# EasyEDA Pro project test Project_2026-04-05_21-01-09.eprj, schematic Schematic1
Board Name: Board1; Create Date: 2026-05-06; Page Name: P1; Project Name: test Project_2026-04-05_21-01-09; Schematic Name: Schematic1; Update Date: 2026-06-16; Company: EasyEDA.com; Page Size: A4; Version: V1.0
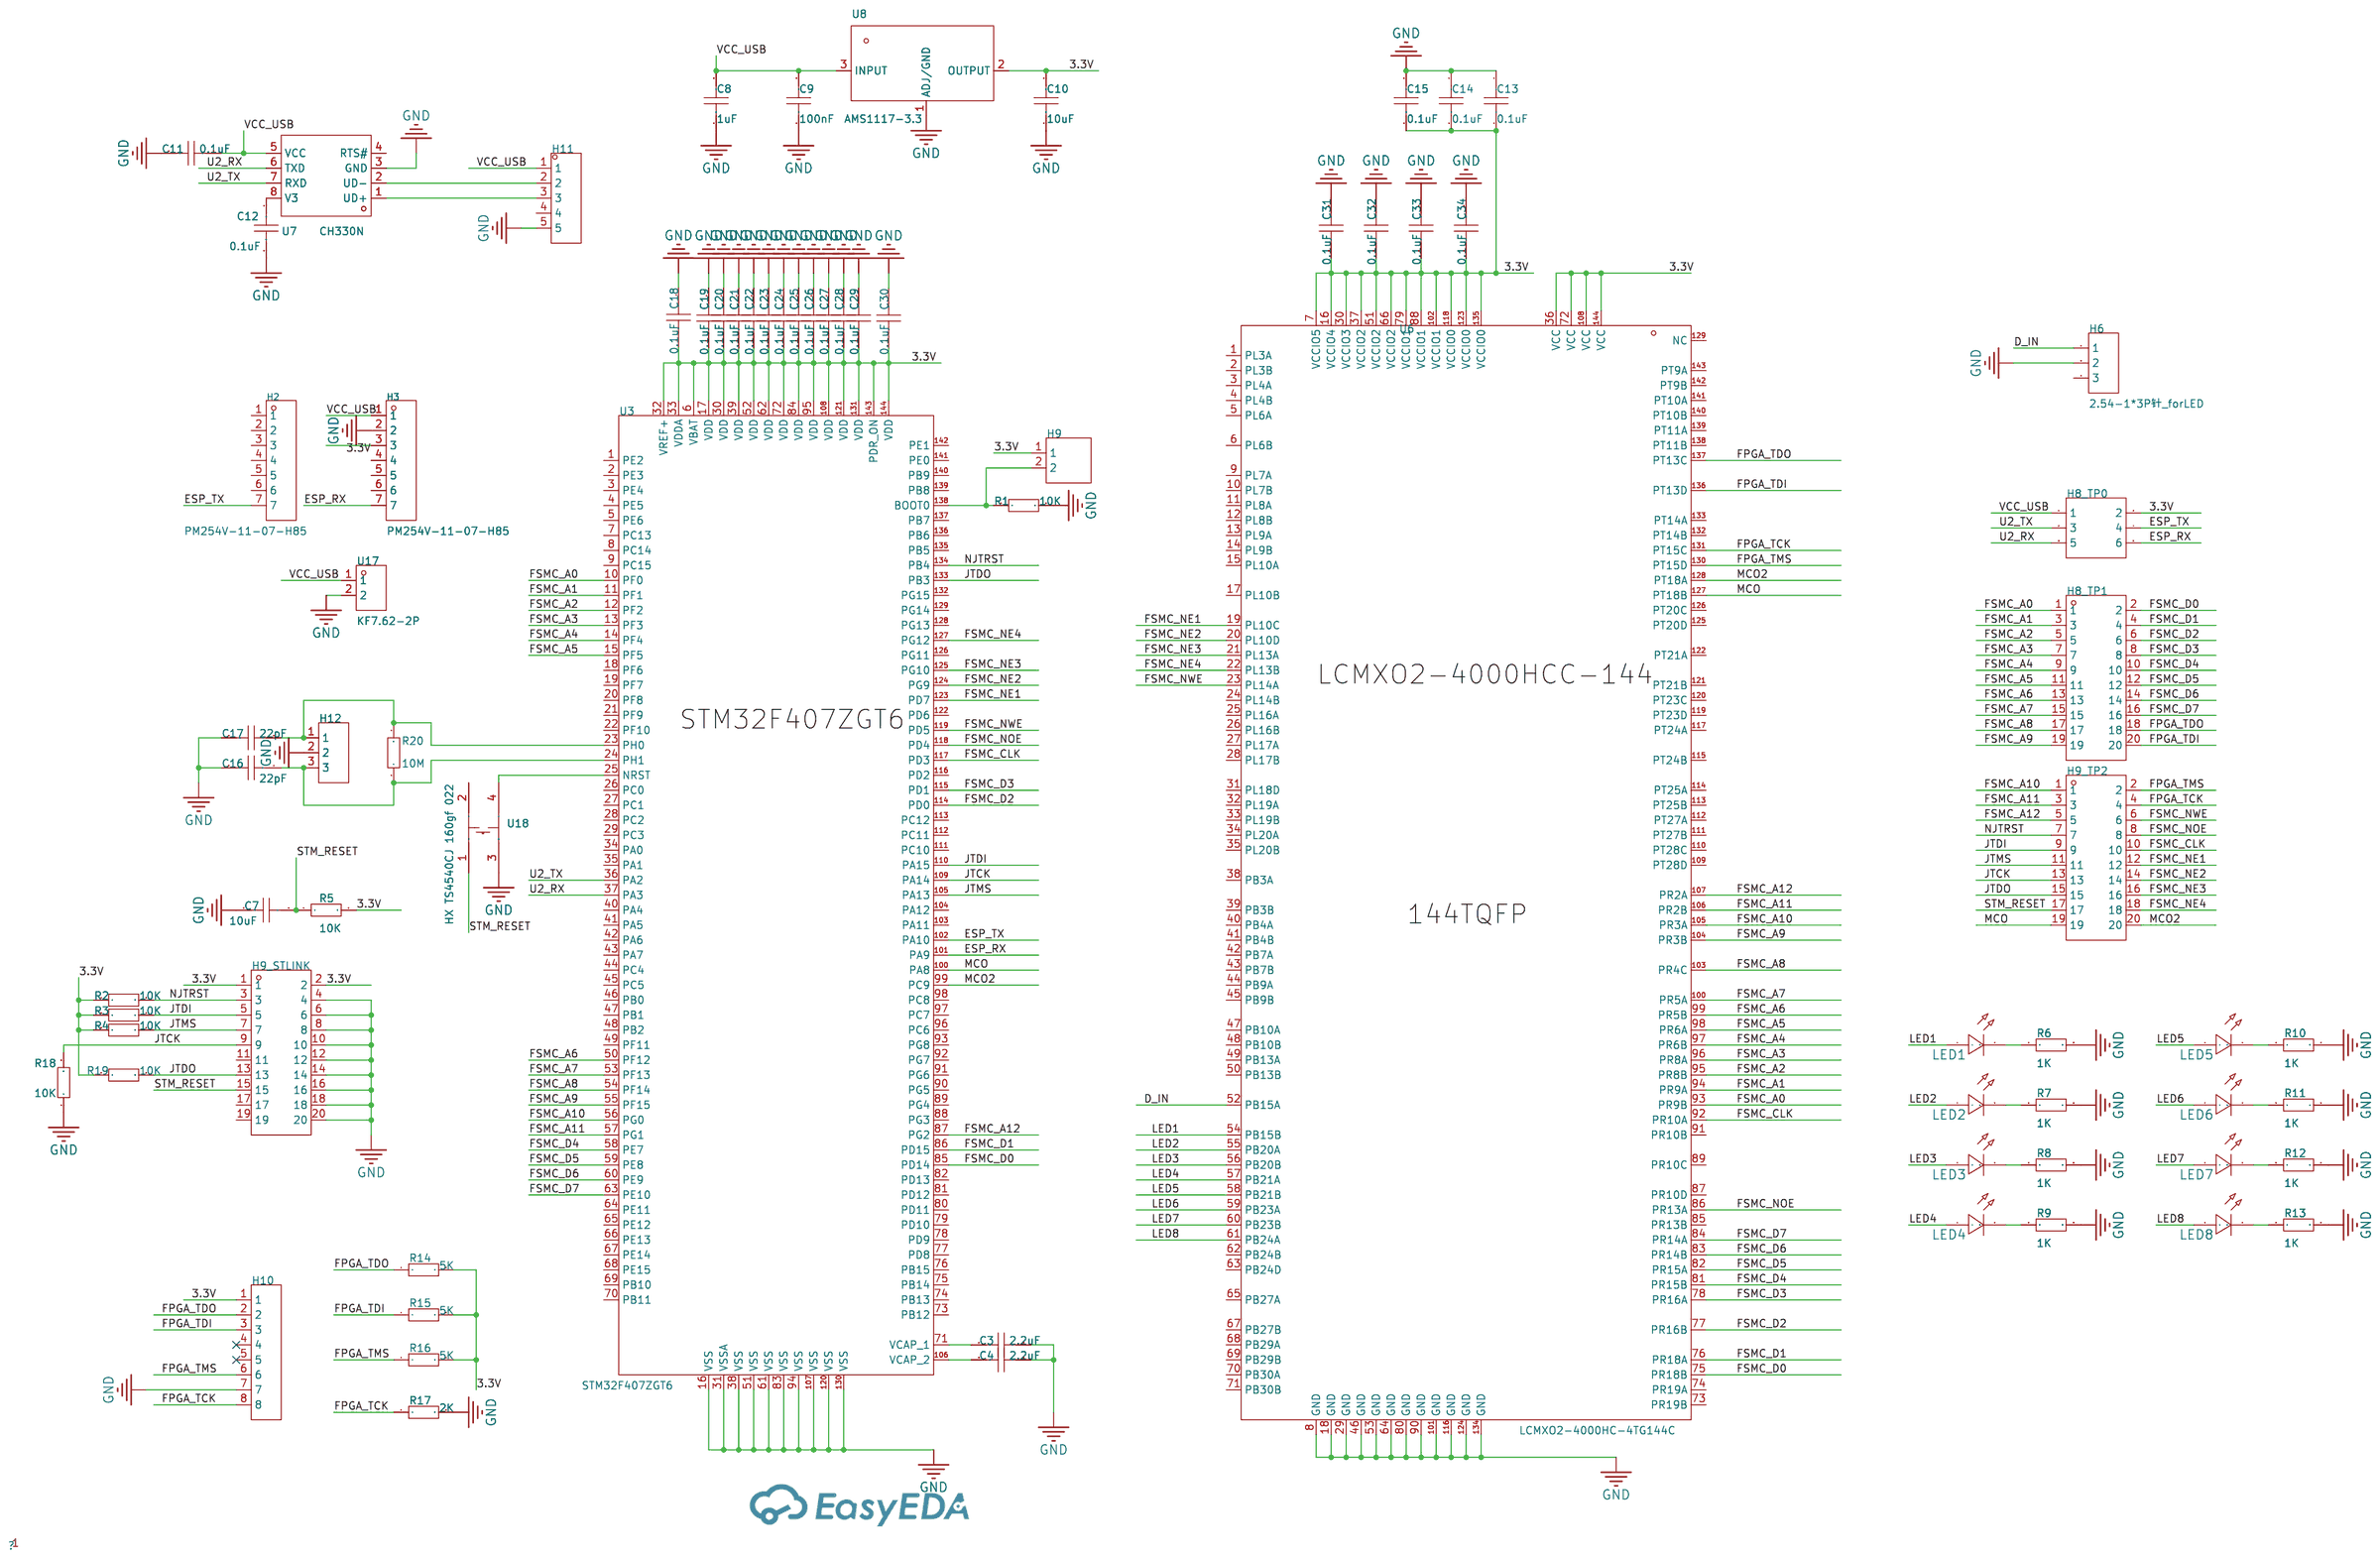
[diagram p0: schematic sheet]

## Parts
C3  2.2uF  [C0805]
C4  2.2uF  [C0805]
C7  10uF  [C0805]
C8  1uF  [C0805]
C9  100nF  [C0805]
C10  10uF  [C0805]
C11  0.1uF  [C0805]
C12  0.1uF  [C0805]
C13  0.1uF  [C0805]
C14  0.1uF  [C0805]
C15  0.1uF  [C0805]
C16  22pF  [C0805]
C17  22pF  [C0805]
C18  0.1uF  [C0805]
C19  0.1uF  [C0805]
C20  0.1uF  [C0805]
C21  0.1uF  [C0805]
C22  0.1uF  [C0805]
C23  0.1uF  [C0805]
C24  0.1uF  [C0805]
C25  0.1uF  [C0805]
C26  0.1uF  [C0805]
C27  0.1uF  [C0805]
C28  0.1uF  [C0805]
C29  0.1uF  [C0805]
C30  0.1uF  [C0805]
C31  0.1uF  [C0805]
C32  0.1uF  [C0805]
C33  0.1uF  [C0805]
C34  0.1uF  [C0805]
H2  PM254V-11-07-H85  [HDR-TH_7P-P2.54-V-F]
H3  PM254V-11-07-H85  [HDR-TH_7P-P2.54-V-F]
H6  2.54-1*3P针_forLED  [HDR-TH_3P-P2.54-V-M-1]
H8_TP0  -  [HDR-TH_6P-P2.54-V-R2-C3-S2.54_A2541WV-2X3P]
H8_TP1  -  [HDR-TH_20P-P2.54-V-M-R2-C10-S2.54]
H9  -  [HDR-TH_2P-P2.54-V-M-1]
H9_STLINK  -  [HDR-TH_20P-P2.54-V-M-R2-C10-S2.54]
H9_TP2  -  [HDR-TH_20P-P2.54-V-M-R2-C10-S2.54]
H10  -  [HDR-TH_8P-P2.54-V-F-1]
H11  -  [HDR-TH_5P-P2.54-V-M]
H12  -  [HDR-TH_3P-P2.54-V-F]
LED1  -  [LED0805-R-RD]
LED2  -  [LED0805-R-RD]
LED3  -  [LED0805-R-RD]
LED4  -  [LED0805-R-RD]
LED5  -  [LED0805-R-RD]
LED6  -  [LED0805-R-RD]
LED7  -  [LED0805-R-RD]
LED8  -  [LED0805-R-RD]
R1  10K  [R0805]
R2  10K  [R0805]
R3  10K  [R0805]
R4  10K  [R0805]
R5  10K  [R0805]
R6  1K  [R0805]
R7  1K  [R0805]
R8  1K  [R0805]
R9  1K  [R0805]
R10  1K  [R0805]
R11  1K  [R0805]
R12  1K  [R0805]
R13  1K  [R0805]
R14  5K  [R0805]
R15  5K  [R0805]
R16  5K  [R0805]
R17  2K  [R0805]
R18  10K  [R0805]
R19  10K  [R0805]
R20  10M  [R0805]
U3  STM32F407ZGT6  [LQFP-144_L20.0-W20.0-P0.50-LS22.0-BL]
U6  LCMXO2-4000HC-4TG144C  [TQFP-144_L20.0-W20.0-P0.50-LS22.0-BL]
U7  CH330N  [SOP-8_L4.9-W3.9-P1.27-LS6.0-BL]
U8  AMS1117-3.3  [SOT-223-3_L6.7-W3.7-P2.30-LS7.0-BR]
U17  KF7.62-2P  [CONN-TH_KF7.62-2P]
U18  HX TS4540CJ 160gf 022  [KEY-TH_4P-L4.5-W4.5-P3.00-LS5.0-TL]

## Library data of the parts
C3 C4 C7-C34 = CAP_0805: Supplier Footprint: 0805
H2 H3 = PM254V-11-07-H85: Holes Structure:1x7P Pitch:2.54mm Row Spacing:- Circular Hole / Square Hole:Square Hole Mounting Type:Through Hole Number of Rows:1 Number of Positions:7P Current Rating:3A Voltage Rating (Max):250V Holes Direction:Top Insulation Height:- Operating Temper; LCSC Part Name: 间距:2.54mm 1x7P 直插; Supplier Part: C2832270; Manufacturer: XFCN(兴飞); Supplier Footprint: 插件,P=2.54mm; JLCPCB Part Class: 扩展库; Datasheet: https://item.szlcsc.com/datasheet/PM254V-11-07-H85/2989788.html; Supplier: LCSC; Holes Structure: 1x7P; Pitch: 2.54mm; Circular Hole / Square Hole: Square Hole; Mounting Type: Through Hole; Number of Rows: 1; Number of Positions: 7P; Current Rating: 3A; Voltage Rating (Max): 250V; Holes Direction: Top; Operating Temperature: -40℃~+105℃
H6 = 2.54-1*3P针: LCSC Part Name: 1x3P 间距:2.54mm 方针 直插; Supplier Part: C49257; Manufacturer: BOOMELE(博穆精密); Supplier Footprint: 插件,P=2.54mm; JLCPCB Part Class: 扩展库; Datasheet: https://item.szlcsc.com/datasheet/2.54-1*3P%25E9%2592%2588/50265.html; Supplier: LCSC; Pin Structure: 1x3P; Pitch: 2.54mm; Circluar Pins/Square Pins: Pin Header; Mounting Type: Through Hole; Number of Rows: 1; Number of Pins: 3P; Current Rating: 3A; Length of Mating Pin: 6mm; Insulation Height: 2.5mm; Length of End Connection Pin: 3mm; Contact Material: Brass; Contact Plating: Gold; Operating Temperature: -40℃~+105℃; Color: Black
H8_TP0 = HDR-M_2.54_2x3: Supplier Footprint: Through
H8_TP1 H9_STLINK H9_TP2 = HDR-M_2.54_2x10: Supplier Footprint: Through
H9 = HDR-M_2.54_1x2P: Supplier Footprint: Through
H10 = HDR-F_2.54_1x8P: Supplier Footprint: Through
H11 = HDR-M_2.54_1x5P: Supplier Footprint: Through
H12 = HDR-F_2.54_1x3P: Supplier Footprint: Through
LED1-LED8 = LED_0805-R: Supplier Footprint: 0805
R1-R20 = Res_0805: Supplier Footprint: 0805
U3 = STM32F407ZGT6: CPU Core:ARM-M4 CPU Maximum Speed:168MHz Program Storage Size:1MB Program Memory Type:FLASH Number of I/O:114 ADC (Bit):12bit DAC (Bit):12bit Voltage - Supply:1.8V~3.6V Voltage - Supply:1.8V~3.6V Applications:-; LCSC Part Name: 带DSP和FPU的高性能基础系列ARM Cortex-M4 MCU，具有1 MB Flash、168 MHz CPU、ART加速器、以太网和FSMC; Supplier Part: C19156; Manufacturer: ST(意法半导体); Supplier Footprint: LQFP-144(20x20); JLCPCB Part Class: Extended Part; Datasheet: https://item.szlcsc.com/datasheet/STM32F407ZGT6/19860.html; Supplier: LCSC; CPU Core: ARM-M4; CPU Maximum Speed: 168MHz; Program Storage Size: 1MB; Program Memory Type: FLASH; Number of I/O: 114; ADC (Bit): 12bit; DAC (Bit): 12bit; Voltage - Supply: 1.8V~3.6V
U6 = LCMXO2-4000HC-4TG144C: Type:- Voltage - Supply(VCCIO):- Voltage - Supply(VCCIO):- Number of Logic Elements/Blocks:4320 Logic Array Blocks:540 Embedded Block RAM:94208bit Operating Temperature:0℃~+85℃ Operating Temperature:0℃~+85℃; LCSC Part Name: LCMXO2 4000HC 4TG144C; Supplier Part: C1521625; Manufacturer: LATTICE(莱迪思); Supplier Footprint: TQFP-144(20x20); JLCPCB Part Class: Extended Part; Datasheet: https://item.szlcsc.com/datasheet/LCMXO2-4000HC-4TG144C/1612423.html; Supplier: LCSC; Number of Logic Elements/Blocks: 4320; Logic Array Blocks: 540; Embedded Block RAM: 94208bit; Operating Temperature: 0℃~+85℃
U7 = CH330N: Applications Function:Transceiver Protocol: Supply Voltage:3.3V；5V Supply Voltage:3.3V；5V Data Rate:2Mbps; LCSC Part Name: CH330N 停产; Supplier Part: C108996; Manufacturer: WCH(南京沁恒); Supplier Footprint: SOP-8; JLCPCB Part Class: 扩展库; Datasheet: https://atta.szlcsc.com/upload/public/pdf/source/20240313/064151622E5EBEB2C93E60CEFC89359A.pdf; Supplier: LCSC; Applications Function: Transceiver; Supply Voltage: 3.3V；5V; Data Rate: 2Mbps
U8 = AMS1117-3.3_C41414107: Output Type:Fixed Voltage - Supply:15V Output Voltage:3.3V Output Voltage:3.3V Output Current:800mA Power Supply Rejection Ratio (PSRR):75dB@(120Hz) Voltage Dropout:1.25V@(1A) standby current:- Noise:0.003%Vout Features:Over Current Protection；Over Temper; Supplier Part: C41414107; Manufacturer: YONGYUTAI(永裕泰); Supplier Footprint: TO-252; JLCPCB Part Class: Extended Part; Datasheet: https://item.szlcsc.com/datasheet/AMS1117-3.3/43231650.html; Supplier: LCSC; Output Type: Fixed; Voltage - Supply: 15V; Output Voltage: 3.3V; Output Current: 800mA; Power Supply Rejection Ratio (PSRR): 75dB@(120Hz); Voltage Dropout: 1.25V@(1A); Noise: 0.003%Vout; Features: Over Current Protection；Over Temperature Protection; Operating Temperature: -40℃~+125℃@(TJ); Output Configuration: Positive; Number of Outputs: 1
U17 = KF7.62-2P: LCSC Part Name: 黑色 7.62mm 1x2P 直插 边脚 排数:1 每排P数:2; Supplier Part: C707824; Manufacturer: KEFA(科发); Supplier Footprint: 插件,P=7.62mm; JLCPCB Part Class: Extended Part; Datasheet: https://item.szlcsc.com/datasheet/KF7.62-2P/745033.html; Supplier: LCSC; Barrier Type: 2-Side; Pitch: 7.62mm; Number of Positions or Pins: 1x2P; Mounting Type: Straight; Pin Location: Side Mount; Number of Pins: 2P; Number of Rows: 1; Number of PINs Per Row: 2; Current Rating: 24A; Voltage Rating (Max): 450V; Wire Gauge - AWG: 12~22; Wire Gauge - mm2: 2.5; Operating Temperature: -40℃~+105℃; Color: Black
U18 = HX TS4540CJ 160gf 022: LCSC Part Name: 四脚插件立式 4.5*4.5*4.0mm 不锈钢弹片 160gf; Supplier Part: C7463293; Manufacturer: hanxia(韩下); Supplier Footprint: DIP; JLCPCB Part Class: 扩展库; Datasheet: https://item.szlcsc.com/datasheet/HX%2520TS4540CJ%2520160gf%2520022/8497484.html; Supplier: LCSC; Circuit: SPST; Actuator Style: Round Button; Operating Force: 1.6N; Mounting Type: Through Hole; Length: 4.5mm; Width: 4.5mm; Switch Height: 4mm; Contact Current: 50mA; Voltage Rating: 12V; Actuator/Cap Color: Black; With Lamp: No; Life: 50,000 cycles; Operating Temperature: -16℃~+60℃

## Nets
3.3V: C10.1 C13.2 C14.2 C15.2 C18.2 C19.2 C20.2 C21.2 C22.2 C23.2 C24.2 C25.2 C26.2 C27.2 C28.2 C29.2 C30.2 C31.2 C32.2 C33.2 C34.2 H3.3 H8_TP0.2 H9.1 H9_STLINK.1 H9_STLINK.2 H10.1 R2.1 R3.1 R4.1 R5.2 R14.2 R15.2 R16.2 R19.1 U3.6(VBAT) U3.17(VDD) U3.30(VDD) U3.32(VREF+) U3.33(VDDA) U3.39(VDD) U3.52(VDD) U3.62(VDD) U3.72(VDD) U3.84(VDD) U3.95(VDD) U3.108(VDD) U3.121(VDD) U3.131(VDD) U3.143(PDR_ON) U3.144(VDD) U6.7(VCCIO5) U6.16(VCCIO4) U6.30(VCCIO3) U6.36(VCC) U6.37(VCCIO2) U6.51(VCCIO2) U6.66(VCCIO2) U6.72(VCC) U6.79(VCCIO1) U6.88(VCCIO1) U6.102(VCCIO1) U6.108(VCC) U6.118(VCCIO0) U6.123(VCCIO0) U6.135(VCCIO0) U6.144(VCC) U8.2(OUTPUT)
GND: C3.1 C4.1 C7.2 C8.2 C9.2 C10.2 C11.2 C12.2 C13.1 C14.1 C15.1 C16.2 C17.2 C18.1 C19.1 C20.1 C21.1 C22.1 C23.1 C24.1 C25.1 C26.1 C27.1 C28.1 C29.1 C30.1 C31.1 C32.1 C33.1 C34.1 H3.2 H6.2 H9_STLINK.4 H9_STLINK.6 H9_STLINK.8 H9_STLINK.10 H9_STLINK.12 H9_STLINK.14 H9_STLINK.16 H9_STLINK.18 H9_STLINK.20 H10.7 H11.5 H12.2 R1.2 R6.2 R7.2 R8.2 R9.2 R10.2 R11.2 R12.2 R13.2 R17.2 R18.1 U3.16(VSS) U3.31(VSSA) U3.38(VSS) U3.51(VSS) U3.61(VSS) U3.83(VSS) U3.94(VSS) U3.107(VSS) U3.120(VSS) U3.130(VSS) U6.8(GND) U6.18(GND) U6.29(GND) U6.46(GND) U6.53(GND) U6.64(GND) U6.80(GND) U6.90(GND) U6.101(GND) U6.116(GND) U6.124(GND) U6.134(GND) U7.3(GND) U8.1(ADJ/GND) U17.2 U18.3
VCC_USB: C8.1 C9.1 C11.1 H3.1 H8_TP0.1 H11.1 U7.5(VCC) U8.3(INPUT) U17.1
D_IN: H6.1 U6.52(PB15A)
ESP_RX: H3.7 H8_TP0.6 U3.101(PA9)
ESP_TX: H2.7 H8_TP0.4 U3.102(PA10)
FPGA_TCK: H9_TP2.4 H10.8 R17.1 U6.131(PT15C)
FPGA_TDI: H8_TP1.20 H10.3 R15.1 U6.136(PT13D)
FPGA_TDO: H8_TP1.18 H10.2 R14.1 U6.137(PT13C)
FPGA_TMS: H9_TP2.2 H10.6 R16.1 U6.130(PT15D)
FSMC_A0: H8_TP1.1 U3.10(PF0) U6.93(PR9B)
FSMC_A1: H8_TP1.3 U3.11(PF1) U6.94(PR9A)
FSMC_A2: H8_TP1.5 U3.12(PF2) U6.95(PR8B)
FSMC_A3: H8_TP1.7 U3.13(PF3) U6.96(PR8A)
FSMC_A4: H8_TP1.9 U3.14(PF4) U6.97(PR6B)
FSMC_A5: H8_TP1.11 U3.15(PF5) U6.98(PR6A)
FSMC_A6: H8_TP1.13 U3.50(PF12) U6.99(PR5B)
FSMC_A7: H8_TP1.15 U3.53(PF13) U6.100(PR5A)
FSMC_A8: H8_TP1.17 U3.54(PF14) U6.103(PR4C)
FSMC_A9: H8_TP1.19 U3.55(PF15) U6.104(PR3B)
FSMC_A10: H9_TP2.1 U3.56(PG0) U6.105(PR3A)
FSMC_A11: H9_TP2.3 U3.57(PG1) U6.106(PR2B)
FSMC_A12: H9_TP2.5 U3.87(PG2) U6.107(PR2A)
FSMC_CLK: H9_TP2.10 U3.117(PD3) U6.92(PR10A)
FSMC_D0: H8_TP1.2 U3.85(PD14) U6.75(PR18B)
FSMC_D1: H8_TP1.4 U3.86(PD15) U6.76(PR18A)
FSMC_D2: H8_TP1.6 U3.114(PD0) U6.77(PR16B)
FSMC_D3: H8_TP1.8 U3.115(PD1) U6.78(PR16A)
FSMC_D4: H8_TP1.10 U3.58(PE7) U6.81(PR15B)
FSMC_D5: H8_TP1.12 U3.59(PE8) U6.82(PR15A)
FSMC_D6: H8_TP1.14 U3.60(PE9) U6.83(PR14B)
FSMC_D7: H8_TP1.16 U3.63(PE10) U6.84(PR14A)
FSMC_NE1: H9_TP2.12 U3.123(PD7) U6.19(PL10C)
FSMC_NE2: H9_TP2.14 U3.124(PG9) U6.20(PL10D)
FSMC_NE3: H9_TP2.16 U3.125(PG10) U6.21(PL13A)
FSMC_NE4: H9_TP2.18 U3.127(PG12) U6.22(PL13B)
FSMC_NOE: H9_TP2.8 U3.118(PD4) U6.86(PR13A)
FSMC_NWE: H9_TP2.6 U3.119(PD5) U6.23(PL14A)
JTCK: H9_STLINK.9 H9_TP2.13 R18.2 U3.109(PA14)
JTDI: H9_STLINK.5 H9_TP2.9 R3.2 U3.110(PA15)
JTDO: H9_STLINK.13 H9_TP2.15 R19.2 U3.133(PB3)
JTMS: H9_STLINK.7 H9_TP2.11 R4.2 U3.105(PA13)
LED1: LED1.1(A) U6.54(PB15B)
LED2: LED2.1(A) U6.55(PB20A)
LED3: LED3.1(A) U6.56(PB20B)
LED4: LED4.1(A) U6.57(PB21A)
LED5: LED5.1(A) U6.58(PB21B)
LED6: LED6.1(A) U6.59(PB23A)
LED7: LED7.1(A) U6.60(PB23B)
LED8: LED8.1(A) U6.61(PB24A)
MCO: H9_TP2.19 U3.100(PA8) U6.127(PT18B)
MCO2: H9_TP2.20 U3.99(PC9) U6.128(PT18A)
NJTRST: H9_STLINK.3 H9_TP2.7 R2.2 U3.134(PB4)
STM_RESET: C7.1 H9_STLINK.15 H9_TP2.17 R5.1 U18.1
U2_RX: H8_TP0.5 U3.37(PA3) U7.6(TXD)
U2_TX: H8_TP0.3 U3.36(PA2) U7.7(RXD)
$1N9899: C3.2 U3.71(VCAP_1)
$1N9927: C4.2 U3.106(VCAP_2)
$1N10441: C16.1 H12.3 R20.1 U3.24(PH1)
$1N10459: H9.2 R1.1 U3.138(BOOT0)
$1N11231: U3.25(NRST) U18.4
$1N13880: H11.2 U7.2(UD-)
$1N13884: H11.3 U7.1(UD+)
$1N21011: LED4.2(C) R9.1
$1N21018: LED3.2(C) R8.1
$1N21026: LED2.2(C) R7.1
$1N21031: LED1.2(C) R6.1
$1N21156: LED5.2(C) R10.1
$1N21160: LED6.2(C) R11.1
$1N21165: LED7.2(C) R12.1
$1N21170: LED8.2(C) R13.1
$1N33872: C17.1 H12.1 R20.2 U3.23(PH0)
$1N35655: C12.1 U7.8(V3)

Not connected (* = marked no-connect by the designer): H2 1 2 3 4 5 6; H3 4 5 6; H6 3; H9_STLINK 11 17 19; H10 4* 5*; H11 4; U3 1(PE2) 2(PE3) 3(PE4) 4(PE5) 5(PE6) 7(PC13) 8(PC14) 9(PC15) 18(PF6) 19(PF7) 20(PF8) 21(PF9) 22(PF10) 26(PC0) 27(PC1) 28(PC2) 29(PC3) 34(PA0) 35(PA1) 40(PA4) 41(PA5) 42(PA6) 43(PA7) 44(PC4) 45(PC5) 46(PB0) 47(PB1) 48(PB2) 49(PF11) 64(PE11) 65(PE12) 66(PE13) 67(PE14) 68(PE15) 69(PB10) 70(PB11) 73(PB12) 74(PB13) 75(PB14) 76(PB15) 77(PD8) 78(PD9) 79(PD10) 80(PD11) 81(PD12) 82(PD13) 88(PG3) 89(PG4) 90(PG5) 91(PG6) 92(PG7) 93(PG8) 96(PC6) 97(PC7) 98(PC8) 103(PA11) 104(PA12) 111(PC10) 112(PC11) 113(PC12) 116(PD2) 122(PD6) 126(PG11) 128(PG13) 129(PG14) 132(PG15) 135(PB5) 136(PB6) 137(PB7) 139(PB8) 140(PB9) 141(PE0) 142(PE1); U6 1(PL3A) 2(PL3B) 3(PL4A) 4(PL4B) 5(PL6A) 6(PL6B) 9(PL7A) 10(PL7B) 11(PL8A) 12(PL8B) 13(PL9A) 14(PL9B) 15(PL10A) 17(PL10B) 24(PL14B) 25(PL16A) 26(PL16B) 27(PL17A) 28(PL17B) 31(PL18D) 32(PL19A) 33(PL19B) 34(PL20A) 35(PL20B) 38(PB3A) 39(PB3B) 40(PB4A) 41(PB4B) 42(PB7A) 43(PB7B) 44(PB9A) 45(PB9B) 47(PB10A) 48(PB10B) 49(PB13A) 50(PB13B) 62(PB24B) 63(PB24D) 65(PB27A) 67(PB27B) 68(PB29A) 69(PB29B) 70(PB30A) 71(PB30B) 73(PR19B) 74(PR19A) 85(PR13B) 87(PR10D) 89(PR10C) 91(PR10B) 109(PT28D) 110(PT28C) 111(PT27B) 112(PT27A) 113(PT25B) 114(PT25A) 115(PT24B) 117(PT24A) 119(PT23D) 120(PT23C) 121(PT21B) 122(PT21A) 125(PT20D) 126(PT20C) 129(NC) 132(PT14B) 133(PT14A) 138(PT11B) 139(PT11A) 140(PT10B) 141(PT10A) 142(PT9B) 143(PT9A); U7 4(RTS#); U18 2
